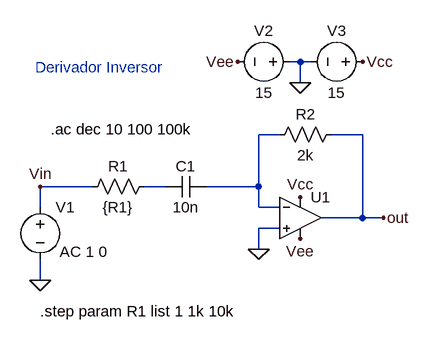
[diagram p0: schematic 5 - Derivador Inversor.asc]
5 - Derivador Inversor.asc, the LTspice schematic file:
Version 4
SHEET 1 880 680
WIRE 224 -16 208 -16
WIRE 240 -16 224 -16
WIRE 224 16 224 -16
WIRE 192 96 160 96
WIRE 320 96 272 96
WIRE -96 176 -176 176
WIRE 16 176 -16 176
WIRE 160 176 160 96
WIRE 160 176 80 176
WIRE -176 208 -176 176
WIRE 160 208 160 176
WIRE 192 208 160 208
WIRE 320 224 320 96
WIRE 320 224 256 224
WIRE 352 224 320 224
WIRE 192 240 160 240
WIRE 160 272 160 240
WIRE -176 320 -176 288
FLAG 224 16 0
FLAG 128 -16 Vee
FLAG 320 -16 Vcc
FLAG 224 192 Vcc
FLAG 224 256 Vee
FLAG 160 272 0
FLAG -176 320 0
FLAG -176 176 Vin
FLAG 352 224 out
SYMBOL voltage 224 -16 R90
WINDOW 0 -32 56 VBottom 2
WINDOW 3 32 56 VTop 2
WINDOW 123 0 0 Left 0
WINDOW 39 0 0 Left 0
SYMATTR InstName V2
SYMATTR Value 15
SYMBOL voltage 336 -16 R90
WINDOW 0 -32 56 VBottom 2
WINDOW 3 32 56 VTop 2
WINDOW 123 0 0 Left 0
WINDOW 39 0 0 Left 0
SYMATTR InstName V3
SYMATTR Value 15
SYMBOL res 288 80 R90
WINDOW 0 0 56 VBottom 2
WINDOW 3 32 56 VTop 2
SYMATTR InstName R2
SYMATTR Value 2k
SYMBOL res 0 160 R90
WINDOW 0 0 56 VBottom 2
WINDOW 3 32 56 VTop 2
SYMATTR InstName R1
SYMATTR Value {R1}
SYMBOL voltage -176 192 R0
WINDOW 123 30 84 Left 2
WINDOW 39 0 0 Left 0
WINDOW 3 24 96 Invisible 2
SYMATTR Value2 AC 1 0
SYMATTR Value SINE(0 1 1k)
SYMATTR InstName V1
SYMBOL OpAmps\\UniversalOpAmp2 224 224 R0
SYMATTR InstName U1
SYMBOL cap 80 160 R90
WINDOW 0 0 32 VBottom 2
WINDOW 3 32 32 VTop 2
SYMATTR InstName C1
SYMATTR Value 10n
TEXT -176 368 Left 2 !.step param R1 list 1 1k 10k
TEXT -184 -8 Left 2 ;Derivador Inversor
TEXT -160 88 Left 2 !.ac dec 10 100 100k

The netlist it stands for:
* 5 - Derivador Inversor.asc
V2 0 Vee 15
V3 Vcc 0 15
R2 out N001 2k
R1 N002 Vin {R1}
V1 Vin 0 SINE(0 1 1k) AC 1 0
XU1 0 N001 Vcc Vee out level2 Avol=1Meg GBW=10Meg Slew=10Meg Ilimit=25m Rail=0 Vos=0 En=0 Enk=0 In=0 Ink=0 Rin=500Meg  ; pins In+ In- V+ V- OUT
C1 N001 N002 10n
.step param R1 list 1 1k 10k
* Derivador Inversor
.ac dec 10 100 100k
.lib UniversalOpAmp2.lib
.backanno
.end